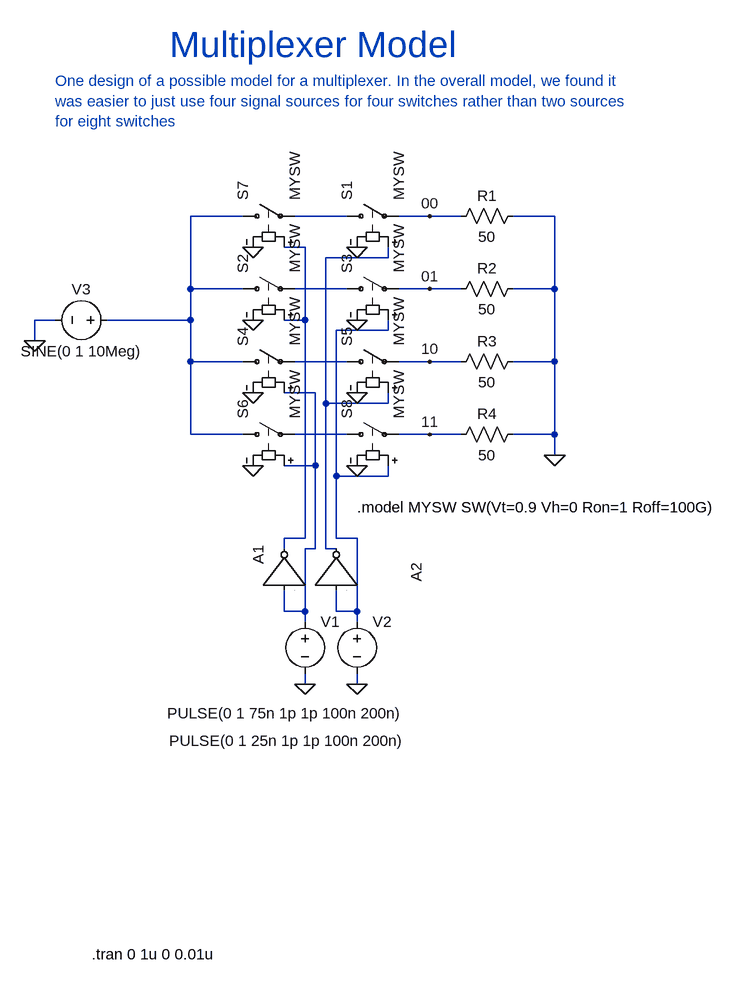
[diagram p0: schematic MUXModel.asc]
MUXModel.asc, the LTspice schematic file:
Version 4
SHEET 1 1112 680
WIRE 128 -496 48 -496
WIRE 288 -496 208 -496
WIRE 416 -496 368 -496
WIRE 464 -496 416 -496
WIRE 608 -496 544 -496
WIRE 224 -448 192 -448
WIRE 352 -432 352 -448
WIRE 352 -432 256 -432
WIRE 48 -384 48 -496
WIRE 128 -384 48 -384
WIRE 288 -384 208 -384
WIRE 416 -384 368 -384
WIRE 464 -384 416 -384
WIRE 608 -384 608 -496
WIRE 608 -384 544 -384
WIRE -160 -336 -192 -336
WIRE 48 -336 48 -384
WIRE 48 -336 -80 -336
WIRE 224 -336 224 -448
WIRE 224 -336 192 -336
WIRE 352 -320 352 -336
WIRE 352 -320 272 -320
WIRE -192 -304 -192 -336
WIRE 48 -272 48 -336
WIRE 128 -272 48 -272
WIRE 288 -272 208 -272
WIRE 416 -272 368 -272
WIRE 464 -272 416 -272
WIRE 608 -272 608 -384
WIRE 608 -272 544 -272
WIRE 240 -224 192 -224
WIRE 256 -208 256 -432
WIRE 352 -208 352 -224
WIRE 352 -208 256 -208
WIRE 48 -160 48 -272
WIRE 128 -160 48 -160
WIRE 288 -160 208 -160
WIRE 416 -160 368 -160
WIRE 464 -160 416 -160
WIRE 608 -160 608 -272
WIRE 608 -160 544 -160
WIRE 608 -128 608 -160
WIRE 240 -112 240 -224
WIRE 240 -112 192 -112
WIRE 272 -96 272 -320
WIRE 352 -96 352 -112
WIRE 352 -96 272 -96
WIRE 224 0 224 -336
WIRE 224 0 192 0
WIRE 272 0 272 -96
WIRE 304 0 272 0
WIRE 192 16 192 0
WIRE 240 16 240 -112
WIRE 240 16 224 16
WIRE 256 16 256 -208
WIRE 272 16 256 16
WIRE 192 112 192 80
WIRE 224 112 224 16
WIRE 224 112 192 112
WIRE 272 112 272 80
WIRE 304 112 304 0
WIRE 304 112 272 112
WIRE 224 128 224 112
WIRE 304 128 304 112
WIRE 224 224 224 208
WIRE 304 224 304 208
FLAG 224 224 0
FLAG 304 224 0
FLAG 144 -448 0
FLAG 304 -448 0
FLAG 144 -336 0
FLAG 304 -336 0
FLAG 144 -224 0
FLAG 304 -224 0
FLAG 144 -112 0
FLAG 304 -112 0
FLAG -192 -304 0
FLAG 608 -128 0
FLAG 416 -496 00
FLAG 416 -384 01
FLAG 416 -160 11
FLAG 416 -272 10
SYMBOL sw 112 -496 R270
SYMATTR InstName S7
SYMATTR Value MYSW
SYMBOL voltage 224 112 R0
WINDOW 3 -212 157 Left 2
WINDOW 123 0 0 Left 0
WINDOW 39 0 0 Left 0
SYMATTR Value PULSE(0 1 75n 1p 1p 100n 200n)
SYMATTR InstName V1
SYMBOL voltage 304 112 R0
WINDOW 3 -289 199 Left 2
WINDOW 123 0 0 Left 0
WINDOW 39 0 0 Left 0
SYMATTR Value PULSE(0 1 25n 1p 1p 100n 200n)
SYMATTR InstName V2
SYMBOL Digital\\inv 128 80 R270
SYMATTR InstName A1
SYMBOL Digital\\inv 208 80 R270
WINDOW 0 13 187 Left 2
SYMATTR InstName A2
SYMBOL sw 272 -496 R270
SYMATTR InstName S1
SYMATTR Value MYSW
SYMBOL sw 112 -384 R270
SYMATTR InstName S2
SYMATTR Value MYSW
SYMBOL sw 272 -384 R270
SYMATTR InstName S3
SYMATTR Value MYSW
SYMBOL sw 112 -272 R270
SYMATTR InstName S4
SYMATTR Value MYSW
SYMBOL sw 272 -272 R270
SYMATTR InstName S5
SYMATTR Value MYSW
SYMBOL sw 112 -160 R270
SYMATTR InstName S6
SYMATTR Value MYSW
SYMBOL sw 272 -160 R270
SYMATTR InstName S8
SYMATTR Value MYSW
SYMBOL voltage -64 -336 R90
WINDOW 0 -32 56 VBottom 2
WINDOW 3 32 56 VTop 2
WINDOW 123 0 0 Left 0
WINDOW 39 0 0 Left 0
SYMATTR InstName V3
SYMATTR Value SINE(0 1 10Meg)
SYMBOL res 560 -512 R90
WINDOW 0 0 56 VBottom 2
WINDOW 3 32 56 VTop 2
SYMATTR InstName R1
SYMATTR Value 50
SYMBOL res 560 -400 R90
WINDOW 0 0 56 VBottom 2
WINDOW 3 32 56 VTop 2
SYMATTR InstName R2
SYMATTR Value 50
SYMBOL res 560 -288 R90
WINDOW 0 0 56 VBottom 2
WINDOW 3 32 56 VTop 2
SYMATTR InstName R3
SYMATTR Value 50
SYMBOL res 560 -176 R90
WINDOW 0 0 56 VBottom 2
WINDOW 3 32 56 VTop 2
SYMATTR InstName R4
SYMATTR Value 50
TEXT 304 -48 Left 2 !.model MYSW SW(Vt=0.9 Vh=0 Ron=1 Roff=100G)
TEXT -104 640 Left 2 !.tran 0 1u 0 0.01u
TEXT 16 -760 Left 5 ;Multiplexer Model
TEXT -160 -704 Left 2 ;One design of a possible model for a multiplexer. In the overall model, we found it\nwas easier to just use four signal sources for four switches rather than two sources\nfor eight switches

The netlist it stands for:
* MUXModel.asc
S7 N001 N002 N003 0 MYSW
V1 N008 0 PULSE(0 1 75n 1p 1p 100n 200n)
V2 N006 0 PULSE(0 1 25n 1p 1p 100n 200n)
A1 N008 0 0 0 0 N003 0 0 BUF
A2 N006 0 0 0 0 N004 0 0 BUF
S1 N002 00 N004 0 MYSW
S2 N001 N005 N003 0 MYSW
S3 N005 01 N006 0 MYSW
S4 N001 N007 N008 0 MYSW
S5 N007 10 N004 0 MYSW
S6 N001 N009 N008 0 MYSW
S8 N009 11 N006 0 MYSW
V3 N001 0 SINE(0 1 10Meg)
R1 0 00 50
R2 0 01 50
R3 0 10 50
R4 0 11 50
.model MYSW SW(Vt=0.9 Vh=0 Ron=1 Roff=100G)
.tran 0 1u 0 0.01u
* Multiplexer Model
* One design of a possible model for a multiplexer. In the overall model, we found it
* was easier to just use four signal sources for four switches rather than two sources
* for eight switches
.backanno
.end